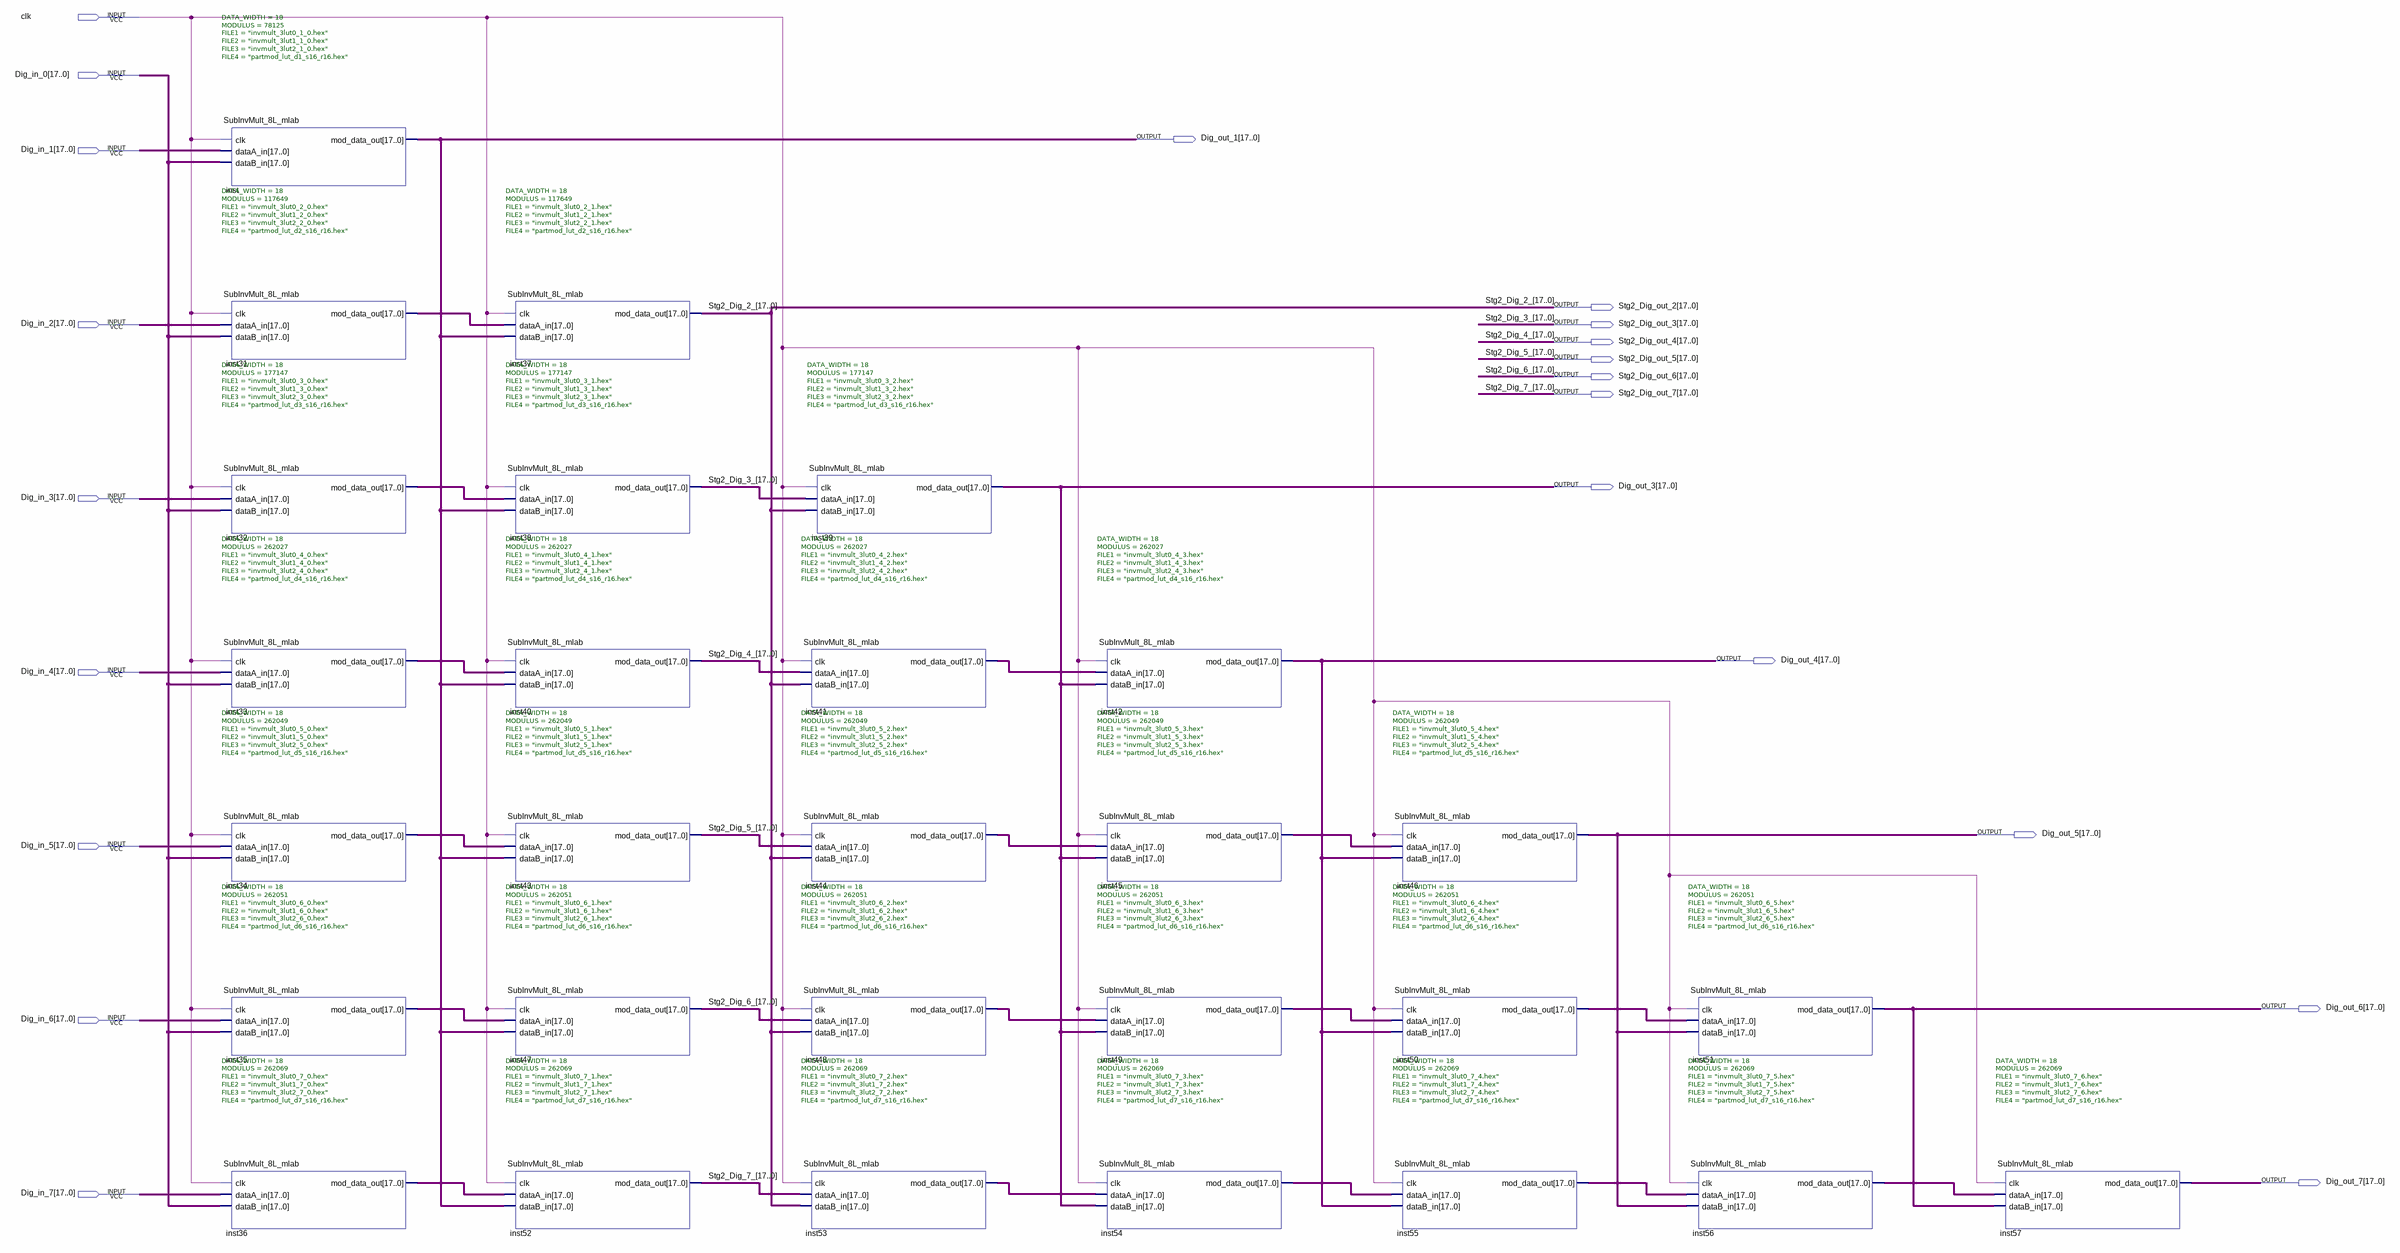
[diagram p0: schematic sheet]
// Quartus schematic MRC_pipe_mlab_stg2out.bdf as structural Verilog: 28 symbols, 21 pins
module MRC_pipe_mlab_stg2out (
  input  clk,
  input  [17:0] Dig_in_0,
  input  [17:0] Dig_in_1,
  input  [17:0] Dig_in_2,
  input  [17:0] Dig_in_3,
  input  [17:0] Dig_in_4,
  input  [17:0] Dig_in_5,
  input  [17:0] Dig_in_6,
  input  [17:0] Dig_in_7,
  output [17:0] Dig_out_1,
  output [17:0] Stg2_Dig_out_2,
  output [17:0] Stg2_Dig_out_3,
  output [17:0] Stg2_Dig_out_4,
  output [17:0] Stg2_Dig_out_5,
  output [17:0] Stg2_Dig_out_6,
  output [17:0] Stg2_Dig_out_7,
  output [17:0] Dig_out_3,
  output [17:0] Dig_out_4,
  output [17:0] Dig_out_5,
  output [17:0] Dig_out_6,
  output [17:0] Dig_out_7
);

  wire [17:0] inst31_mod_data_out, inst32_mod_data_out, inst33_mod_data_out, inst34_mod_data_out,
       inst35_mod_data_out, inst36_mod_data_out, inst41_mod_data_out, inst44_mod_data_out,
       inst45_mod_data_out, inst48_mod_data_out, inst49_mod_data_out, inst50_mod_data_out,
       inst53_mod_data_out, inst54_mod_data_out, inst55_mod_data_out, inst56_mod_data_out;

  SubInvMult_8L_mlab #(.DATA_WIDTH(18), .MODULUS(78125), .FILE1("invmult_3lut0_1_0.hex"), .FILE2("invmult_3lut1_1_0.hex"), .FILE3("invmult_3lut2_1_0.hex"), .FILE4("partmod_lut_d1_s16_r16.hex")) inst (
    .clk(clk), .dataA_in(Dig_in_1), .dataB_in(Dig_in_0), .mod_data_out(Dig_out_1));
  SubInvMult_8L_mlab #(.DATA_WIDTH(18), .MODULUS(117649), .FILE1("invmult_3lut0_2_0.hex"), .FILE2("invmult_3lut1_2_0.hex"), .FILE3("invmult_3lut2_2_0.hex"), .FILE4("partmod_lut_d2_s16_r16.hex")) inst31 (
    .clk(clk), .dataA_in(Dig_in_2), .dataB_in(Dig_in_0), .mod_data_out(inst31_mod_data_out));
  SubInvMult_8L_mlab #(.DATA_WIDTH(18), .MODULUS(177147), .FILE1("invmult_3lut0_3_0.hex"), .FILE2("invmult_3lut1_3_0.hex"), .FILE3("invmult_3lut2_3_0.hex"), .FILE4("partmod_lut_d3_s16_r16.hex")) inst32 (
    .clk(clk), .dataA_in(Dig_in_3), .dataB_in(Dig_in_0), .mod_data_out(inst32_mod_data_out));
  SubInvMult_8L_mlab #(.DATA_WIDTH(18), .MODULUS(262027), .FILE1("invmult_3lut0_4_0.hex"), .FILE2("invmult_3lut1_4_0.hex"), .FILE3("invmult_3lut2_4_0.hex"), .FILE4("partmod_lut_d4_s16_r16.hex")) inst33 (
    .clk(clk), .dataA_in(Dig_in_4), .dataB_in(Dig_in_0), .mod_data_out(inst33_mod_data_out));
  SubInvMult_8L_mlab #(.DATA_WIDTH(18), .MODULUS(262049), .FILE1("invmult_3lut0_5_0.hex"), .FILE2("invmult_3lut1_5_0.hex"), .FILE3("invmult_3lut2_5_0.hex"), .FILE4("partmod_lut_d5_s16_r16.hex")) inst34 (
    .clk(clk), .dataA_in(Dig_in_5), .dataB_in(Dig_in_0), .mod_data_out(inst34_mod_data_out));
  SubInvMult_8L_mlab #(.DATA_WIDTH(18), .MODULUS(262051), .FILE1("invmult_3lut0_6_0.hex"), .FILE2("invmult_3lut1_6_0.hex"), .FILE3("invmult_3lut2_6_0.hex"), .FILE4("partmod_lut_d6_s16_r16.hex")) inst35 (
    .clk(clk), .dataA_in(Dig_in_6), .dataB_in(Dig_in_0), .mod_data_out(inst35_mod_data_out));
  SubInvMult_8L_mlab #(.DATA_WIDTH(18), .MODULUS(262069), .FILE1("invmult_3lut0_7_0.hex"), .FILE2("invmult_3lut1_7_0.hex"), .FILE3("invmult_3lut2_7_0.hex"), .FILE4("partmod_lut_d7_s16_r16.hex")) inst36 (
    .clk(clk), .dataA_in(Dig_in_7), .dataB_in(Dig_in_0), .mod_data_out(inst36_mod_data_out));
  SubInvMult_8L_mlab #(.DATA_WIDTH(18), .MODULUS(117649), .FILE1("invmult_3lut0_2_1.hex"), .FILE2("invmult_3lut1_2_1.hex"), .FILE3("invmult_3lut2_2_1.hex"), .FILE4("partmod_lut_d2_s16_r16.hex")) inst37 (
    .clk(clk), .dataA_in(inst31_mod_data_out), .dataB_in(Dig_out_1), .mod_data_out(Stg2_Dig_out_2));
  SubInvMult_8L_mlab #(.DATA_WIDTH(18), .MODULUS(177147), .FILE1("invmult_3lut0_3_1.hex"), .FILE2("invmult_3lut1_3_1.hex"), .FILE3("invmult_3lut2_3_1.hex"), .FILE4("partmod_lut_d3_s16_r16.hex")) inst38 (
    .clk(clk), .dataA_in(inst32_mod_data_out), .dataB_in(Dig_out_1), .mod_data_out(Stg2_Dig_out_3));
  SubInvMult_8L_mlab #(.DATA_WIDTH(18), .MODULUS(262027), .FILE1("invmult_3lut0_4_1.hex"), .FILE2("invmult_3lut1_4_1.hex"), .FILE3("invmult_3lut2_4_1.hex"), .FILE4("partmod_lut_d4_s16_r16.hex")) inst40 (
    .clk(clk), .dataA_in(inst33_mod_data_out), .dataB_in(Dig_out_1), .mod_data_out(Stg2_Dig_out_4));
  SubInvMult_8L_mlab #(.DATA_WIDTH(18), .MODULUS(262049), .FILE1("invmult_3lut0_5_1.hex"), .FILE2("invmult_3lut1_5_1.hex"), .FILE3("invmult_3lut2_5_1.hex"), .FILE4("partmod_lut_d5_s16_r16.hex")) inst43 (
    .clk(clk), .dataA_in(inst34_mod_data_out), .dataB_in(Dig_out_1), .mod_data_out(Stg2_Dig_out_5));
  SubInvMult_8L_mlab #(.DATA_WIDTH(18), .MODULUS(262051), .FILE1("invmult_3lut0_6_1.hex"), .FILE2("invmult_3lut1_6_1.hex"), .FILE3("invmult_3lut2_6_1.hex"), .FILE4("partmod_lut_d6_s16_r16.hex")) inst47 (
    .clk(clk), .dataA_in(inst35_mod_data_out), .dataB_in(Dig_out_1), .mod_data_out(Stg2_Dig_out_6));
  SubInvMult_8L_mlab #(.DATA_WIDTH(18), .MODULUS(262069), .FILE1("invmult_3lut0_7_1.hex"), .FILE2("invmult_3lut1_7_1.hex"), .FILE3("invmult_3lut2_7_1.hex"), .FILE4("partmod_lut_d7_s16_r16.hex")) inst52 (
    .clk(clk), .dataA_in(inst36_mod_data_out), .dataB_in(Dig_out_1), .mod_data_out(Stg2_Dig_out_7));
  SubInvMult_8L_mlab #(.DATA_WIDTH(18), .MODULUS(262027), .FILE1("invmult_3lut0_4_2.hex"), .FILE2("invmult_3lut1_4_2.hex"), .FILE3("invmult_3lut2_4_2.hex"), .FILE4("partmod_lut_d4_s16_r16.hex")) inst41 (
    .clk(clk), .dataA_in(Stg2_Dig_out_4), .dataB_in(Stg2_Dig_out_2), .mod_data_out(inst41_mod_data_out));
  SubInvMult_8L_mlab #(.DATA_WIDTH(18), .MODULUS(262049), .FILE1("invmult_3lut0_5_2.hex"), .FILE2("invmult_3lut1_5_2.hex"), .FILE3("invmult_3lut2_5_2.hex"), .FILE4("partmod_lut_d5_s16_r16.hex")) inst44 (
    .clk(clk), .dataA_in(Stg2_Dig_out_5), .dataB_in(Stg2_Dig_out_2), .mod_data_out(inst44_mod_data_out));
  SubInvMult_8L_mlab #(.DATA_WIDTH(18), .MODULUS(262051), .FILE1("invmult_3lut0_6_2.hex"), .FILE2("invmult_3lut1_6_2.hex"), .FILE3("invmult_3lut2_6_2.hex"), .FILE4("partmod_lut_d6_s16_r16.hex")) inst48 (
    .clk(clk), .dataA_in(Stg2_Dig_out_6), .dataB_in(Stg2_Dig_out_2), .mod_data_out(inst48_mod_data_out));
  SubInvMult_8L_mlab #(.DATA_WIDTH(18), .MODULUS(262069), .FILE1("invmult_3lut0_7_2.hex"), .FILE2("invmult_3lut1_7_2.hex"), .FILE3("invmult_3lut2_7_2.hex"), .FILE4("partmod_lut_d7_s16_r16.hex")) inst53 (
    .clk(clk), .dataA_in(Stg2_Dig_out_7), .dataB_in(Stg2_Dig_out_2), .mod_data_out(inst53_mod_data_out));
  SubInvMult_8L_mlab #(.DATA_WIDTH(18), .MODULUS(177147), .FILE1("invmult_3lut0_3_2.hex"), .FILE2("invmult_3lut1_3_2.hex"), .FILE3("invmult_3lut2_3_2.hex"), .FILE4("partmod_lut_d3_s16_r16.hex")) inst39 (
    .clk(clk), .dataA_in(Stg2_Dig_out_3), .dataB_in(Stg2_Dig_out_2), .mod_data_out(Dig_out_3));
  SubInvMult_8L_mlab #(.DATA_WIDTH(18), .MODULUS(262027), .FILE1("invmult_3lut0_4_3.hex"), .FILE2("invmult_3lut1_4_3.hex"), .FILE3("invmult_3lut2_4_3.hex"), .FILE4("partmod_lut_d4_s16_r16.hex")) inst42 (
    .clk(clk), .dataA_in(inst41_mod_data_out), .dataB_in(Dig_out_3), .mod_data_out(Dig_out_4));
  SubInvMult_8L_mlab #(.DATA_WIDTH(18), .MODULUS(262049), .FILE1("invmult_3lut0_5_3.hex"), .FILE2("invmult_3lut1_5_3.hex"), .FILE3("invmult_3lut2_5_3.hex"), .FILE4("partmod_lut_d5_s16_r16.hex")) inst45 (
    .clk(clk), .dataA_in(inst44_mod_data_out), .dataB_in(Dig_out_3), .mod_data_out(inst45_mod_data_out));
  SubInvMult_8L_mlab #(.DATA_WIDTH(18), .MODULUS(262051), .FILE1("invmult_3lut0_6_3.hex"), .FILE2("invmult_3lut1_6_3.hex"), .FILE3("invmult_3lut2_6_3.hex"), .FILE4("partmod_lut_d6_s16_r16.hex")) inst49 (
    .clk(clk), .dataA_in(inst48_mod_data_out), .dataB_in(Dig_out_3), .mod_data_out(inst49_mod_data_out));
  SubInvMult_8L_mlab #(.DATA_WIDTH(18), .MODULUS(262069), .FILE1("invmult_3lut0_7_3.hex"), .FILE2("invmult_3lut1_7_3.hex"), .FILE3("invmult_3lut2_7_3.hex"), .FILE4("partmod_lut_d7_s16_r16.hex")) inst54 (
    .clk(clk), .dataA_in(inst53_mod_data_out), .dataB_in(Dig_out_3), .mod_data_out(inst54_mod_data_out));
  SubInvMult_8L_mlab #(.DATA_WIDTH(18), .MODULUS(262049), .FILE1("invmult_3lut0_5_4.hex"), .FILE2("invmult_3lut1_5_4.hex"), .FILE3("invmult_3lut2_5_4.hex"), .FILE4("partmod_lut_d5_s16_r16.hex")) inst46 (
    .clk(clk), .dataA_in(inst45_mod_data_out), .dataB_in(Dig_out_4), .mod_data_out(Dig_out_5));
  SubInvMult_8L_mlab #(.DATA_WIDTH(18), .MODULUS(262051), .FILE1("invmult_3lut0_6_4.hex"), .FILE2("invmult_3lut1_6_4.hex"), .FILE3("invmult_3lut2_6_4.hex"), .FILE4("partmod_lut_d6_s16_r16.hex")) inst50 (
    .clk(clk), .dataA_in(inst49_mod_data_out), .dataB_in(Dig_out_4), .mod_data_out(inst50_mod_data_out));
  SubInvMult_8L_mlab #(.DATA_WIDTH(18), .MODULUS(262069), .FILE1("invmult_3lut0_7_4.hex"), .FILE2("invmult_3lut1_7_4.hex"), .FILE3("invmult_3lut2_7_4.hex"), .FILE4("partmod_lut_d7_s16_r16.hex")) inst55 (
    .clk(clk), .dataA_in(inst54_mod_data_out), .dataB_in(Dig_out_4), .mod_data_out(inst55_mod_data_out));
  SubInvMult_8L_mlab #(.DATA_WIDTH(18), .MODULUS(262051), .FILE1("invmult_3lut0_6_5.hex"), .FILE2("invmult_3lut1_6_5.hex"), .FILE3("invmult_3lut2_6_5.hex"), .FILE4("partmod_lut_d6_s16_r16.hex")) inst51 (
    .clk(clk), .dataA_in(inst50_mod_data_out), .dataB_in(Dig_out_5), .mod_data_out(Dig_out_6));
  SubInvMult_8L_mlab #(.DATA_WIDTH(18), .MODULUS(262069), .FILE1("invmult_3lut0_7_5.hex"), .FILE2("invmult_3lut1_7_5.hex"), .FILE3("invmult_3lut2_7_5.hex"), .FILE4("partmod_lut_d7_s16_r16.hex")) inst56 (
    .clk(clk), .dataA_in(inst55_mod_data_out), .dataB_in(Dig_out_5), .mod_data_out(inst56_mod_data_out));
  SubInvMult_8L_mlab #(.DATA_WIDTH(18), .MODULUS(262069), .FILE1("invmult_3lut0_7_6.hex"), .FILE2("invmult_3lut1_7_6.hex"), .FILE3("invmult_3lut2_7_6.hex"), .FILE4("partmod_lut_d7_s16_r16.hex")) inst57 (
    .clk(clk), .dataA_in(inst56_mod_data_out), .dataB_in(Dig_out_6), .mod_data_out(Dig_out_7));

  // Other names for the same wires on the sheet: Stg2_Dig_2_[17:0] = Stg2_Dig_out_2;
  //   Stg2_Dig_3_[17:0] = Stg2_Dig_out_3; Stg2_Dig_4_[17:0] = Stg2_Dig_out_4; Stg2_Dig_5_[17:0] = Stg2_Dig_out_5;
  //   Stg2_Dig_6_[17:0] = Stg2_Dig_out_6; Stg2_Dig_7_[17:0] = Stg2_Dig_out_7
endmodule
